# Altium schematic sheet SPI Control.SchDoc: SPI Control
size 228 x 165 mm; DrawnBy: Joseph Riesen; DocumentNumber: 10; Revision: 1.0; SheetNumber: 10; SheetTotal: 10
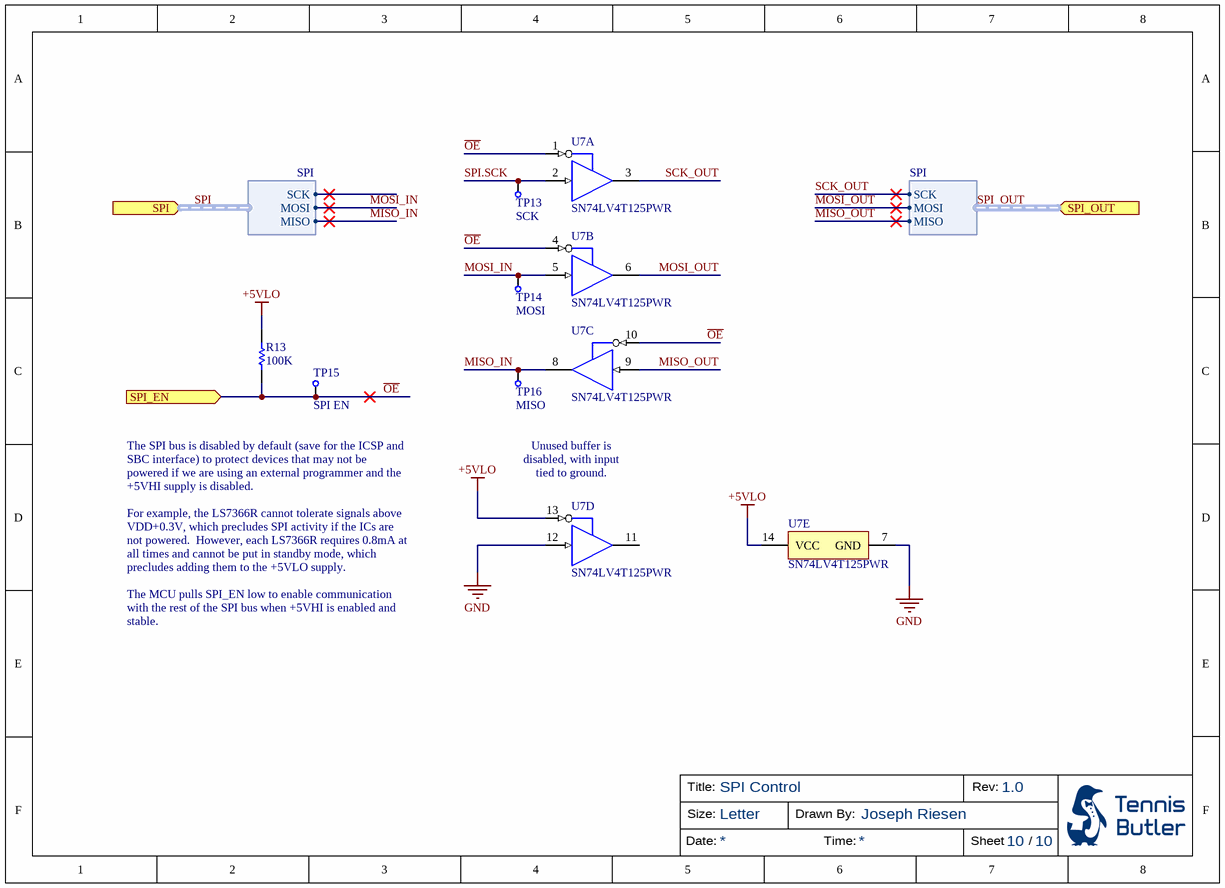
[diagram p0: SPI Control.SchDoc]

## Parts
R13  100K  [RESC2013X70X40ML20T20]
TP13  SCK  [Test Point]  (no BOM)
TP14  MOSI  [Test Point]  (no BOM)
TP15  SPI EN  [Test Point]  (no BOM)
TP16  MISO  [Test Point]  (no BOM)
U7  SN74LV4T125PWR  [TSOP65P640X120-14M]  (parts A,B,C,D,E of 5)

## Ports
SPI (in, harness SPI), SPI_EN (in), SPI_OUT (in, harness SPI)

## Harnesses
SPI: SCK, MOSI, MISO

## Nets
+5VLO: R13.2 U7.13(4~{OE}) U7.14(VCC)
GND: U7.7(GND) U7.12(4A)
MISO_IN: TP16.1 U7.8(3Y) ; port SPI.MISO
MISO_OUT: U7.9(3A) ; port SPI_OUT.MISO
MOSI_IN: TP14.1 U7.5(2A) ; port SPI.MOSI
MOSI_OUT: U7.6(2Y) ; port SPI_OUT.MOSI
~{OE}: R13.1 TP15.1 U7.1(1~{OE}) U7.4(2~{OE}) U7.10(3~{OE}) ; port SPI_EN
SCK_OUT: U7.3(1Y) ; port SPI_OUT.SCK
SPI.SCK: TP13.1 U7.2(1A)

Not connected (* = marked no-connect by the designer): U7 11(4Y)

## Buses and harness runs
harness SPI = port SPI
harness SPI_OUT = port SPI_OUT

## Notes on the sheet
- (near U7) Unused buffer is disabled, with input tied to ground.
- The SPI bus is disabled by default (save for the ICSP and SBC interface) to protect devices that may not be powered if we are using an external programmer and the +5VHI supply is disabled.
  For example, the LS7366R cannot tolerate signals above VDD+0.3V, which precludes SPI activity if the ICs are not powered.  However, each LS7366R requires 0.8mA at all times and cannot be put in standby mode, which precludes adding them to the +5VLO supply.
  The MCU pulls SPI_EN low to enable communication with the rest of the SPI bus when +5VHI is enabled and stable.
- Title:
- Size:
- Letter
- Drawn By:
- Rev:
- Date:
- Time:
- Sheet
- /

## Library data of the parts
R13 = CMP-2001-04377-1: RES SMD 100K OHM 1% 1/8W 0805; Part Number: ERJ-6ENF1003V; Manufacturer: Panasonic
TP13-TP16 = Test Point
U7 = SN74LV4T125PWR: Single Power Supply Quadruple Buffer GATE w/ 3-State Output CMOS Logic Level Shifter, PW0014A, LARGE T&R; Manufacturer: Texas Instruments; Number of Elements: 4; Number of Bits per Element: 1; High Level Output Current: 16mA; Quiescent Current: 2uA; Propagation Delay: 11ns; Min Supply Voltage: 1.6V; Max Supply Voltage: 5.5V; Supplier 1: Digi-Key; Manufacturer Part Number: SN74LV4T125PWR; Stock 1: 20583; Pricing 1: 1 = 1.05000, 10 = 0.93600, 100 = 0.72970, 500 = 0.60276, 1000 = 0.47586 (USD); RoHS 1: Yes; Mount: Surface Mount; Case/Package: TSSOP; Number of Pins: 14; Min Operating Temperature: -40°C; Max Operating Temperature: 125°C; Packaging: Tape and Reel; Low Level Output Current: 16mA; Logic Function: Buffer; Number of Bits: 4; Number of Inputs: 1; Package Quantity: 2000; Radiation Hardening: No; Lead Free: Lead Free; REACH SVHC: No SVHC; ComponentLink1URL: https://datasheet.ciiva.com/48438/sn74lv4t125-48438268.pdf?src-supplier=Avnet; ComponentLink1Description: Datasheet (Avnet); Supplier Part Number 1: 296-40545-1-ND